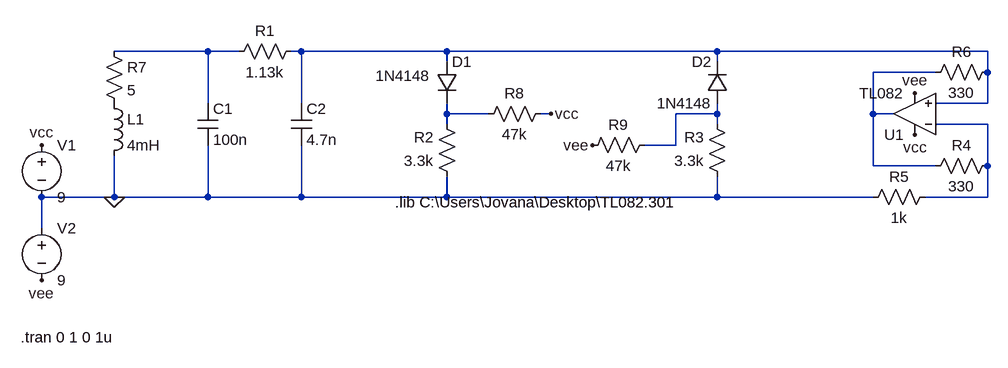
[diagram p0: schematic diode_chua.asc]
diode_chua.asc, the LTspice schematic file:
Version 4
SHEET 1 1584 680
WIRE 256 48 112 48
WIRE 304 48 256 48
WIRE 400 48 384 48
WIRE 624 48 400 48
WIRE 1040 48 624 48
WIRE 1456 48 1040 48
WIRE 624 64 624 48
WIRE 1040 64 1040 48
WIRE 1376 80 1280 80
WIRE 1456 80 1456 48
WIRE 256 128 256 48
WIRE 400 128 400 48
WIRE 1456 128 1456 80
WIRE 1456 128 1376 128
WIRE 624 144 624 128
WIRE 688 144 624 144
WIRE 784 144 768 144
WIRE 1040 144 1040 128
WIRE 1040 144 976 144
WIRE 1280 144 1280 80
WIRE 1312 144 1280 144
WIRE 624 160 624 144
WIRE 1040 160 1040 144
WIRE 1456 160 1376 160
WIRE 976 192 976 144
WIRE 976 192 928 192
WIRE 1280 224 1280 144
WIRE 1376 224 1280 224
WIRE 1456 224 1456 160
WIRE 112 272 112 208
WIRE 112 272 0 272
WIRE 256 272 256 192
WIRE 256 272 112 272
WIRE 400 272 400 192
WIRE 400 272 256 272
WIRE 624 272 624 240
WIRE 624 272 400 272
WIRE 1040 272 1040 240
WIRE 1040 272 624 272
WIRE 1280 272 1040 272
WIRE 1456 272 1456 224
WIRE 1456 272 1360 272
WIRE 0 320 0 272
FLAG 1344 176 vcc
FLAG 1344 112 vee
FLAG 0 400 vee
FLAG 0 192 vcc
FLAG 112 272 0
FLAG 784 144 vcc
FLAG 848 192 vee
SYMBOL ind 96 112 R0
SYMATTR InstName L1
SYMATTR Value 4mH
SYMBOL cap 240 128 R0
SYMATTR InstName C1
SYMATTR Value 100n
SYMBOL cap 384 128 R0
SYMATTR InstName C2
SYMATTR Value 4.7n
SYMBOL res 400 32 R90
WINDOW 0 0 56 VBottom 2
WINDOW 3 32 56 VTop 2
SYMATTR InstName R1
SYMATTR Value 1.13k
SYMBOL diode 608 64 R0
WINDOW 3 -94 21 Left 2
SYMATTR Value 1N4148
SYMATTR InstName D1
SYMBOL res 640 256 R180
WINDOW 0 36 76 Left 2
WINDOW 3 36 40 Left 2
SYMATTR InstName R2
SYMATTR Value 3.3k
SYMBOL diode 1056 128 R180
WINDOW 0 24 64 Left 2
WINDOW 3 24 0 Left 2
SYMATTR InstName D2
SYMATTR Value 1N4148
SYMBOL res 1056 256 R180
WINDOW 0 36 76 Left 2
WINDOW 3 36 40 Left 2
SYMATTR InstName R3
SYMATTR Value 3.3k
SYMBOL OpAmps\\opamp2 1344 208 R180
SYMATTR InstName U1
SYMATTR Value TL082
SYMBOL voltage 0 176 R0
SYMATTR InstName V1
SYMATTR Value 9
SYMBOL voltage 0 304 R0
WINDOW 123 0 0 Left 0
WINDOW 39 0 0 Left 0
SYMATTR InstName V2
SYMATTR Value 9
SYMBOL res 1472 208 R90
WINDOW 0 0 56 VBottom 2
WINDOW 3 32 56 VTop 2
SYMATTR InstName R4
SYMATTR Value 330
SYMBOL res 1376 256 R90
WINDOW 0 0 56 VBottom 2
WINDOW 3 32 56 VTop 2
SYMATTR InstName R5
SYMATTR Value 1k
SYMBOL res 1472 64 R90
WINDOW 0 0 56 VBottom 2
WINDOW 3 32 56 VTop 2
SYMATTR InstName R6
SYMATTR Value 330
SYMBOL res 96 32 R0
SYMATTR InstName R7
SYMATTR Value 5
SYMBOL res 672 160 R270
WINDOW 0 32 56 VTop 2
WINDOW 3 0 56 VBottom 2
SYMATTR InstName R8
SYMATTR Value 47k
SYMBOL res 832 208 R270
WINDOW 0 32 56 VTop 2
WINDOW 3 0 56 VBottom 2
SYMATTR InstName R9
SYMATTR Value 47k
TEXT -32 488 Left 2 !.tran 0 1 0 1u
TEXT 544 280 Left 2 !.lib C:\\Users\\Jovana\\Desktop\\TL082.301

The netlist it stands for:
* diode_chua.asc
L1 P001 0 4mH
C1 N001 0 100n
C2 N002 0 4.7n
R1 N002 N001 1.13k
D1 N002 N004 1N4148
R2 0 N004 3.3k
D2 N005 N002 1N4148
R3 0 N005 3.3k
XU1 N002 N006 vcc vee N003 TL082  ; pins In+ In- V+ V- OUT
V1 vcc 0 9
V2 0 vee 9
R4 N006 N003 330
R5 N006 0 1k
R6 N002 N003 330
R7 N001 P001 5
R8 N004 vcc 47k
R9 vee N005 47k
.model D D
.lib standard.dio
.tran 0 1 0 1u
.lib C:\Users\Jovana\Desktop\TL082.301
.backanno
.end